# Altium schematic sheet FanControl.SchDoc: =ProductName
size 420 x 297 mm; CompanyName: ООО "Тахион"; Organization: ООО "Тахион"; SheetNumber: 1; SheetTotal: 1; PageSetup: Record=PageOptions|CenterHorizontal=True|CenterVertical=True|PrintScale=0.94|XCorrection=1.00|YCorrection=1.00|PrintKind=1|BorderSize=5000000|LeftOffset=0|BottomOffset=0|Orientation=1|PaperLength=1000|PaperWidth=1000|Scale=100|PaperSource=7|PrintQuality=-4|MediaType=1|DitherType=10|PaperKind=A4|PrintScaleMode=1; DocumentName: Sheet1.SCHDOC
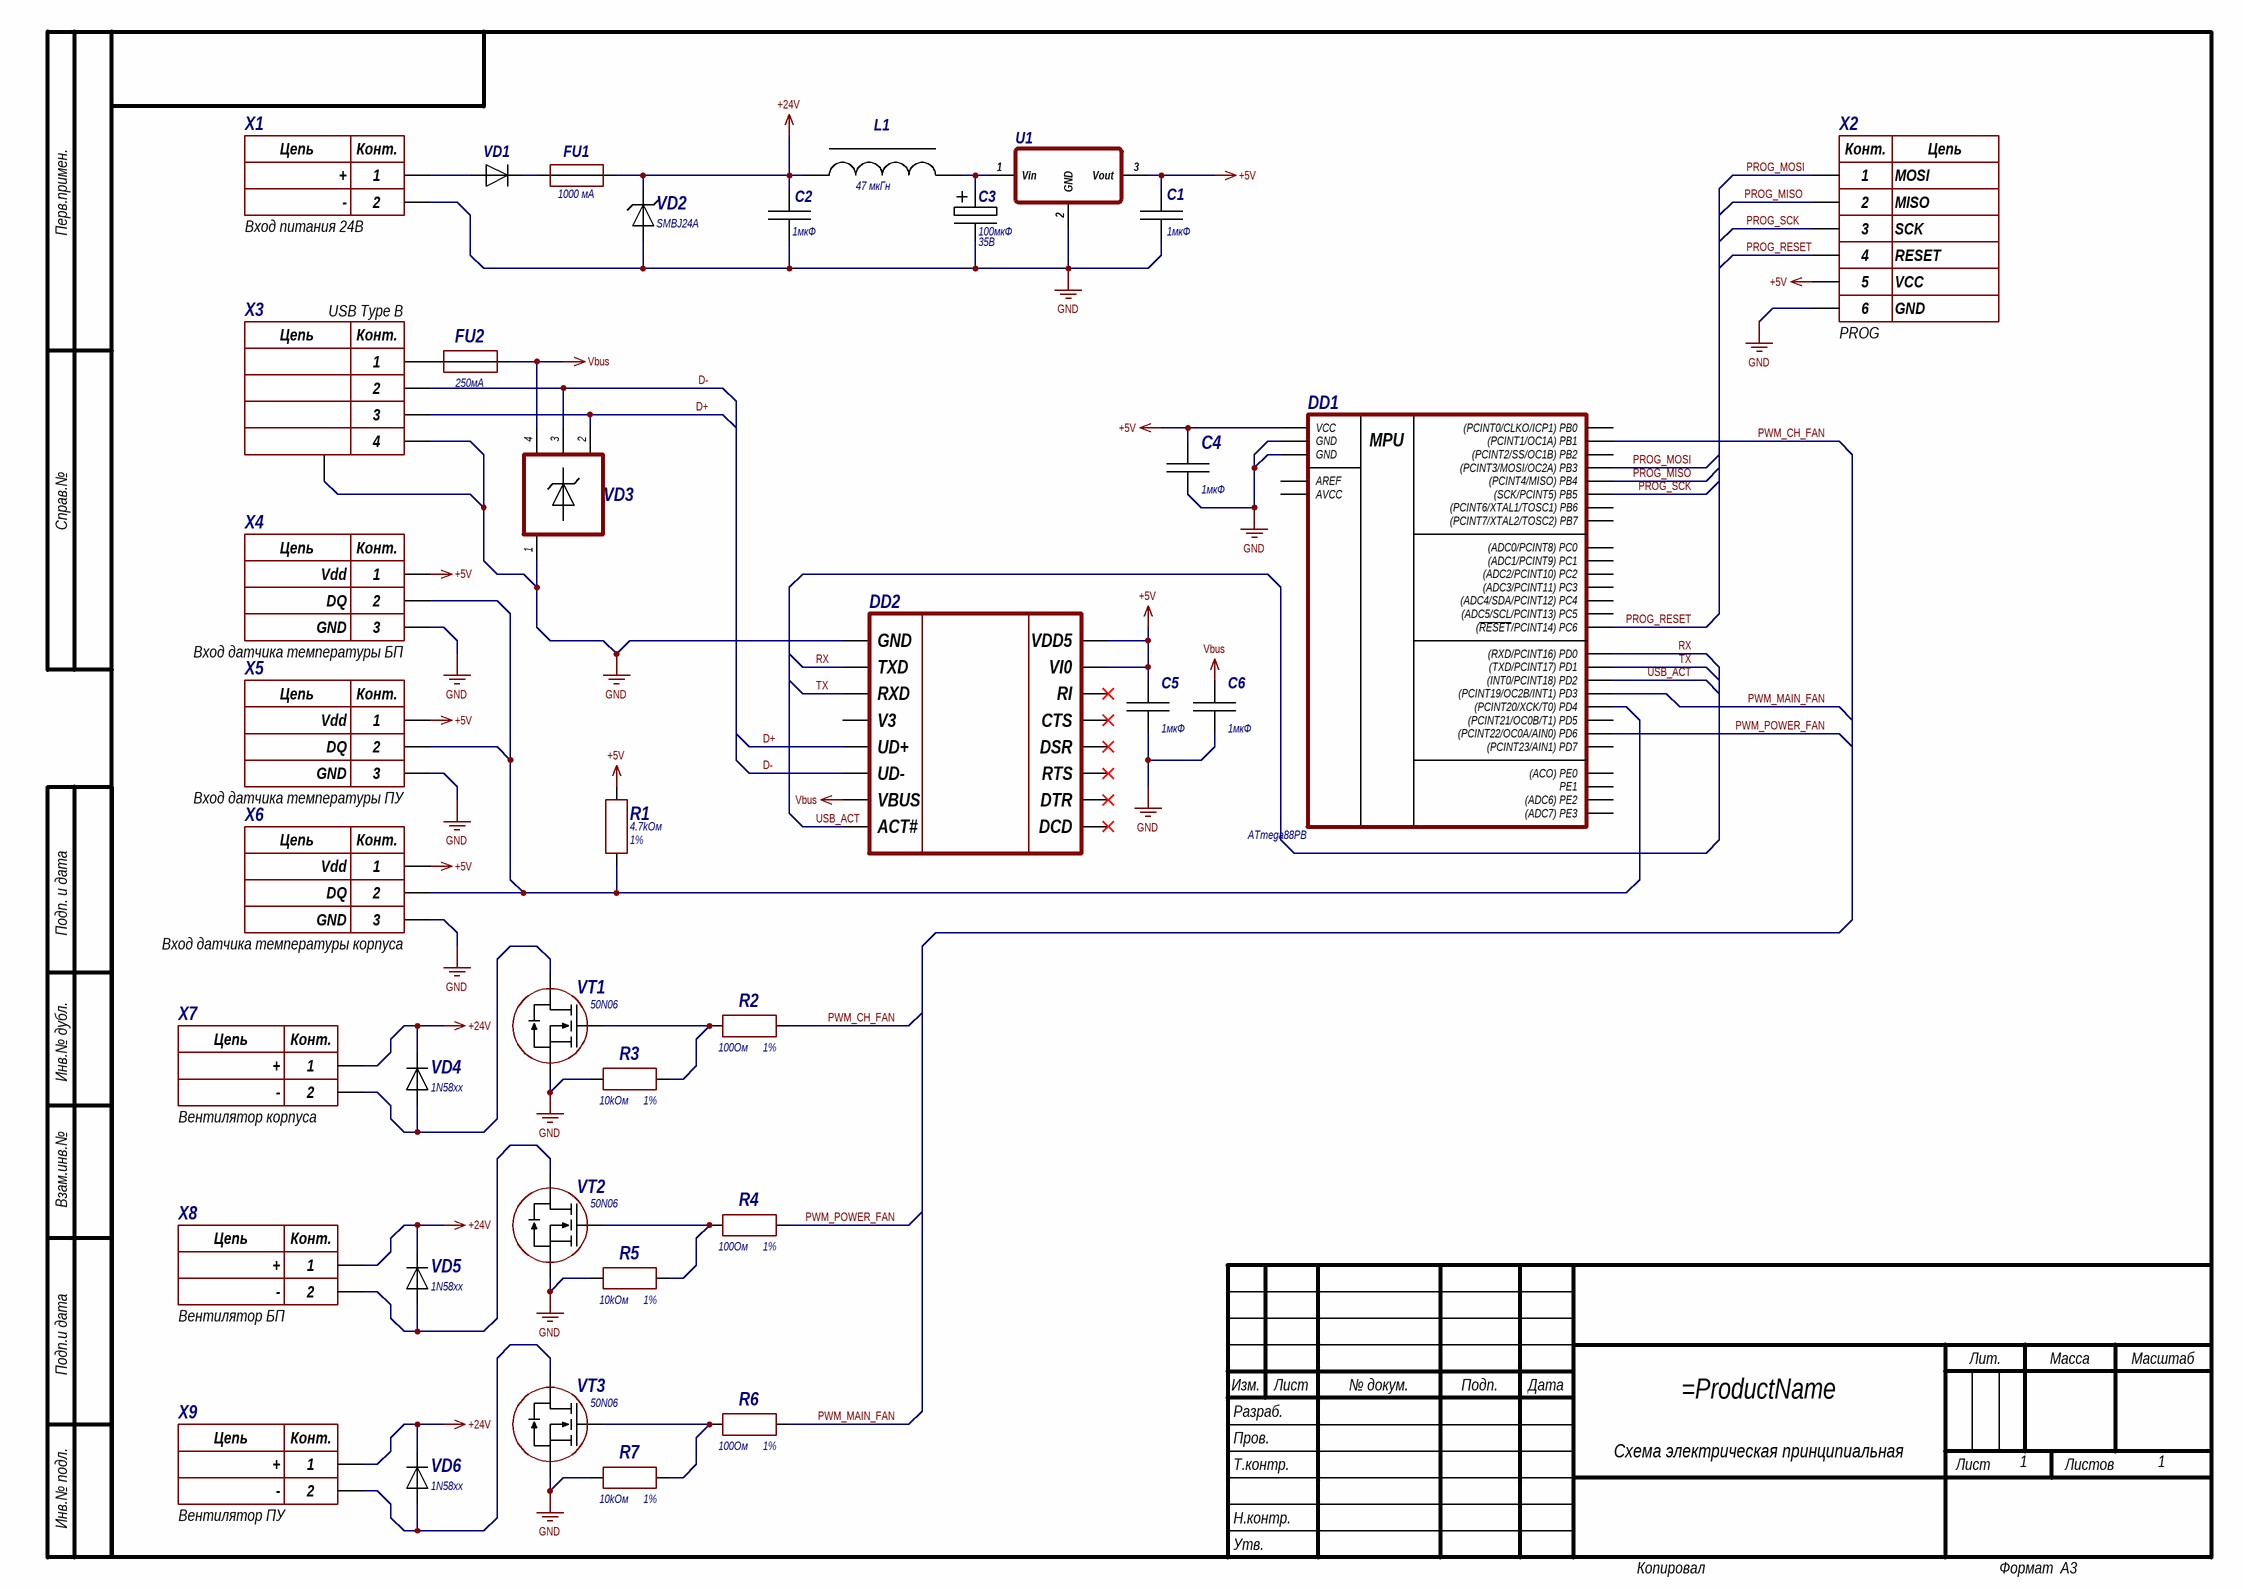
[diagram p0: FanControl.SchDoc]

## Parts
C1  value 1мкФ  [CAP: 0805]  (hidden comment: 0805-X7R-16В-1мкФ±10%)
C2  value 1мкФ  [CAP: 1206]  (hidden comment: 1206-X7R-50В-1мкФ±10%)
C3  value 100мкФ  Voltage: 35В  [UUD]  (hidden comment: ELV-35B-100мкФ±20% тип "D")
C4  value 1мкФ  [FILM Cap]  (hidden comment: 0805-X5R/B-25В-1мкФ±10%)
C5  value 1мкФ  [CAP: 0805]  (hidden comment: 0805-X7R-16В-1мкФ±10%)
C6  value 1мкФ  [CAP: 0805]  (hidden comment: 0805-X7R-16В-1мкФ±10%)
DD1  ATmega8A-AU  [TQFP32]  (value not drawn)
DD2  CH343G  [SOP-16 (1.27, 3.9)]  (value not drawn)
FU1  Сurrent: 1000 мА  [FU: C1]  (hidden comment: 0451001.MRL)
FU2  Сurrent: 250мА  [FU: C1]  (hidden comment: ВП4-18)
L1  Inductance: 47 мкГн  [LQH55D]  (hidden comment: LQH55DN470M03)
R1  value 4.7kОм  Tolerance: 1%  [RES: 0805]  (hidden comment: 0805-0,125Вт-4.7kОм±1%)
R2  value 100Ом  Tolerance: 1%  [RES: 0805]  (hidden comment: 0805-0,125Вт-100Ом±1%)
R3  value 10kОм  Tolerance: 1%  [RES: 0805]  (hidden comment: 0805-0,125Вт-10kОм±1%)
R4  value 100Ом  Tolerance: 1%  [RES: 0805]  (hidden comment: 0805-0,125Вт-100Ом±1%)
R5  value 10kОм  Tolerance: 1%  [RES: 0805]  (hidden comment: 0805-0,125Вт-10kОм±1%)
R6  value 100Ом  Tolerance: 1%  [RES: 0805]  (hidden comment: 0805-0,125Вт-100Ом±1%)
R7  value 10kОм  Tolerance: 1%  [RES: 0805]  (hidden comment: 0805-0,125Вт-10kОм±1%)
U1  LM2940S-5.0/TR  [D2PAK-3]  (value not drawn)
VD1  MBRS2H100T3G  [Diode: SMB (403A)]  (value not drawn)
VD2  SMBJ24A  [Diode: DO-214AA]
VD3  Сборка защитных диодов  [SOT-143]  (value not drawn)
VD4  1N58xx  [Diode: SOD-123]
VD5  1N58xx  [Diode: SOD-123]
VD6  1N58xx  [Diode: SOD-123]
VT1  50N06  [TO-220AB]
VT2  50N06  [TO-220AB]
VT3  50N06  [TO-220AB]
X1  ConName: Вход питания 24В  [PW 10-2-M]  (hidden comment: PW10-02M)
X2  ConName: PROG  [PLD-6]
X3  ConName: USB Type B  [292304-1]
X4  ConName: Вход датчика температуры БП  [WF-3 Hor]  (hidden comment: WF-3R)
X5  ConName: Вход датчика температуры ПУ  [WF-3 Hor]  (hidden comment: WF-3R)
X6  ConName: Вход датчика температуры корпуса  [WF-3 Hor]  (hidden comment: WF-3R)
X7  ConName: Вентилятор корпуса  [PW 10-2-M]  (hidden comment: PW10-02M)
X8  ConName: Вентилятор БП  [PW 10-2-M]  (hidden comment: PW10-02M)
X9  ConName: Вентилятор ПУ  [PW 10-2-M]  (hidden comment: PW10-02M)

## Nets
+5V: C1.1 C4.2 C5.2 DD1.4(VCC) DD2.15(VI0) DD2.16(VDD5) R1.2 U1.3(Vout) X2.5(VCC) X4.1(Vdd) X5.1(Vdd) X6.1(Vdd)
+24V: C2.1 FU1.2 L1.1 VD2.2 VD4.2 VD5.2 VD6.2 X7.1(+) X8.1(+) X9.1(+)
GND: C1.2 C2.2 C3.2 C4.1 C5.1 C6.1 DD1.5(GND) DD1.21(GND) DD2.1(GND) R3.1 R5.1 R7.1 U1.2(GND) VD2.1 VD3.1(GND) VT1.3(I) VT2.3(I) VT3.3(I) X1.2(-) X2.6(GND) X3.4 X3.5 X4.3(GND) X5.3(GND) X6.3(GND)
Vbus: C6.2 DD2.7(VBUS) FU2.2 VD3.4(Vcc)
D+: DD2.5(UD+) VD3.2(I/0_1) X3.3
D-: DD2.6(UD-) VD3.3(I/0_2) X3.2
PROG_MISO: DD1.16((PCINT4/MISO)_PB4) X2.2(MISO)
PROG_MOSI: DD1.15((PCINT3/MOSI/OC2A)_PB3) X2.1(MOSI)
PROG_RESET: DD1.29((~{RESET}/PCINT14)_PC6) X2.4(RESET)
PROG_SCK: DD1.17((SCK/PCINT5)_PB5) X2.3(SCK)
PWM_CH_FAN: DD1.13((PCINT1/OC1A)_PB1) R2.2
PWM_MAIN_FAN: DD1.1((PCINT19/OC2B/INT1)_PD3) R6.2
PWM_POWER_FAN: DD1.10((PCINT22/OC0A/AIN0)_PD6) R4.2
RX: DD1.30((RXD/PCINT16)_PD0) DD2.2(TXD)
TX: DD1.31((TXD/PCINT17)_PD1) DD2.3(RXD)
USB_ACT: DD1.32((INT0/PCINT18)_PD2) DD2.8(ACT#)
NetC3_1: C3.1 L1.2 U1.1(Vin)
NetDD1_2: DD1.2((PCINT20/XCK/T0)_PD4) R1.1 X4.2(DQ) X5.2(DQ) X6.2(DQ)
NetFU1_1: FU1.1 VD1.2
NetFU2_1: FU2.1 X3.1
NetR2_1: R2.1 R3.2 VT1.1(Z)
NetR4_1: R4.1 R5.2 VT2.1(Z)
NetR6_1: R6.1 R7.2 VT3.1(Z)
NetVD1_1: VD1.1 X1.1(+)
NetVD4_1: VD4.1 VT1.2(S) X7.2(-)
NetVD5_1: VD5.1 VT2.2(S) X8.2(-)
NetVD6_1: VD6.1 VT3.2(S) X9.2(-)

Not connected (* = marked no-connect by the designer): DD1 3((ACO)_PE0) 6(PE1) 7((PCINT6/XTAL1/TOSC1)_PB6) 8((PCINT7/XTAL2/TOSC2)_PB7) 9((PCINT21/OC0B/T1)_PD5) 11((PCINT23/AIN1)_PD7) 12((PCINT0/CLKO/ICP1)_PB0) 14((PCINT2/SS/OC1B)_PB2) 18(AVCC) 19((ADC6)_PE2) 20(AREF) 22((ADC7)_PE3) 23((ADC0/PCINT8)_PC0) 24((ADC1/PCINT9)_PC1) 25((ADC2/PCINT10)_PC2) 26((ADC3/PCINT11)_PC3) 27((ADC4/SDA/PCINT12)_PC4) 28((ADC5/SCL/PCINT13)_PC5); DD2 4(V3) 9(DCD)* 10(DTR)* 11(RTS)* 12(DSR)* 13(CTS)* 14(RI)*

## Notes on the sheet
- Типоразмер 2410
- Перв.примен.
- Справ.№
- Подп. и дата
- Инв.№ дубл.
- Взам.инв.№
- Подп.и дата
- Разраб.
- Изм.
- Лист
- № докум.
- Подп.
- Дата
- Лит.
- Масса
- Масштаб
- Т.контр.
- Пров.
- Схема электрическая принципиальная
- Листов
- Инв.№ подл.
- Утв.
- Н.контр.
- Копировал
- Формат  A3
- (in symbol ATmega8/8A/88/168/328) MPU; ATmega88PB
- (in symbol CON2) Цепь; Конт.
- (in symbol CON3) Цепь; Конт.
- (in symbol CON5) Цепь; Конт.
- (in symbol CON6) Конт.; Цепь

## Library data of the parts
C1 = Capactor: Manufacturer: Murata; Part Number: GRM21BR71C105KA01L; Voltage: 16В; TypeDielectric: X7R; Tolerance: 10%; Package: 0805; ComponentLink1Description: Datasheet; ComponentLink1URL: ..\Tahion Devices Library\Datasheet\; ComponentLink2Description: Official Site; ComponentLink3Description: ChipDip
C2 = Capactor: Manufacturer: Murata; Part Number: GRM31BR71H105KA01L; Voltage: 50В; TypeDielectric: X7R; Tolerance: 10%; Package: 1206; ComponentLink1Description: Datasheet; ComponentLink1URL: ..\Tahion Devices Library\Datasheet\; ComponentLink2Description: Official Site; ComponentLink3Description: ChipDip
C3 = Capactor El: конденсатор электролитический 100мкФ 20% 50В SMD; Manufacturer: NICHICON; Tolerance: 20%; Package: ELV; Part Number: ELV-35B-100мкФ±20% тип "D"; ComponentLink1Description: Datasheet; ComponentLink1URL: ..\Tahion Devices Library\Datasheet\; ComponentLink2Description: Official Site; ComponentLink3Description: ChipDip
C4 = Capactor: Voltage: 25В; TypeDielectric: X5R/B; Tolerance: 10%; Package: 0805; ComponentLink1Description: Datasheet; ComponentLink1URL: ..\Tahion Devices Library\Datasheet\; ComponentLink2Description: Official Site; ComponentLink3Description: ChipDip
C5 C6 = Capactor: Manufacturer: Murata; Voltage: 16В; TypeDielectric: X7R; Tolerance: 10%; Package: 0805; ComponentLink1Description: Datasheet; ComponentLink1URL: ..\Tahion Devices Library\Datasheet\; ComponentLink2Description: Official Site; ComponentLink3Description: ChipDip
DD1 = ATmega8/8A/88/168/328: Микроконтроллер 8-Бит, AVR, 16МГц, 8КБ Flash / ATmega8/8A/88/168/328; Manufacturer: Microchip Technology; Flash: 8K; EEPROM: 512B; SRAM: 1K; ComponentLink1Description: Datasheet; ComponentLink2Description: Official Site; ComponentLink3Description: ChipDip; Part Number: ATmega8A-AU
DD2 = CH343P/G: Микросхема преобразователя шины USB, которая конвертирует USB в высокоскоростной последовательный интерфейс UART / Драйвер - VCP/CDC; Manufacturer: Nanjing Qinheng Microelectronics Co., Ltd.; Part Number: CH343G
FU1 = FUSE: Manufacturer: Littelfuse; Voltage: 125В; Value: 1000; Part number: 0451001.MRL; ComponentLink1Description: Datasheet; ComponentLink2Description: Official Site; ComponentLink3Description: ChipDip
FU2 = FUSE: Manufacturer: ОАО "Радиодеталь"; Voltage: 350 В; Part number: ВП4-18; ComponentLink1Description: Datasheet; ComponentLink1URL: ..\Tahion Devices Library\Datasheet\; ComponentLink2Description: Official Site; ComponentLink3Description: ChipDip
L1 = Coil_1: Дроссель; Manufacturer: Murata; Part Number: LQH55DN470M03; ComponentLink1Description: Datasheet; ComponentLink1URL: ..\Tahion Devices Library\Datasheet\; ComponentLink2Description: Official Site; ComponentLink3Description: ChipDip
R1-R7 = Resistor: Power: 0,125Вт; Package: 0805; ComponentLink1Description: Datasheet; ComponentLink2Description: Official Site; ComponentLink3Description: ChipDip
  R1: Part Number: 0805-0,125Вт-4.7kОм±1%
  R2 R4 R6: Part Number: 0805-0,125Вт-100Ом±1%
  R3 R5 R7: Part Number: 0805-0,125Вт-10kОм±1%
U1 = Voltage stabilizer: Линейный стабилизатор, вход 6.2-26В, выход 5В/1А; Manufacturer: Texas Instruments; Output voltage: 5В; Maximum input voltage: 26В; Maximum current: 1А; Number of outputs: 1; Part Number: LM2940S-5.0/TR; ComponentLink1Description: Datasheet; ComponentLink1URL: ..\Tahion Devices Library\Datasheet\; ComponentLink2Description: Official Site; ComponentLink3Description: ChipDip
VD1 = Diode: Диод Шоттки; Manufacturer: ON Semiconductor; Max. reverse voltage: 20 В; Part Number: MBRS2H100T3G; ComponentLink1Description: Datasheet; ComponentLink1URL: ..\Tahion Devices Library\Datasheet\MBR0520L.pdf; ComponentLink2Description: Official Site; ComponentLink3Description: ChipDip; ComponentLink2URL: https://www.onsemi.com/products/discrete-power-modules/schottky-diodes-schottky-rectifiers/MBR0520L; ComponentLink3URL: https://www.chipdip.ru/product/mbr0520l
VD2 = Diode TVS: Защитный диод; Manufacturer: UMW (Youtai Semiconductor Co., Ltd.); Part Number: SMBJ24A
VD3 = PRTR5V0U2X: Manufacturer: NXP; Value: 5В; Part Number: PRTR5V0U2X
VD4-VD6 = Diode: Part Number: 1N58xx; ComponentLink1Description: Datasheet; ComponentLink1URL: ..\Tahion Devices Library\Datasheet\MBR0520L.pdf; ComponentLink2Description: Official Site; ComponentLink3Description: ChipDip; ComponentLink2URL: https://www.onsemi.com/products/discrete-power-modules/schottky-diodes-schottky-rectifiers/MBR0520L; ComponentLink3URL: https://www.chipdip.ru/product/mbr0520l
VT1-VT3 = FET SPEED: Транзистор N-MOSFET; Manufacturer: UTD Semiconductor Co.,Ltd; Part Number: 50N06; ComponentLink1Description: Datasheet; ComponentLink1URL: ..\Tahion Devices Library\Datasheet\; ComponentLink2Description: Official Site; ComponentLink3Description: ChipDip
X1 X7-X9 = CON2: Part Number: PW10-02M; ComponentLink1Description: Datasheet; ComponentLink2Description: Official Site; ComponentLink3Description: ChipDip
X2 = CON6: ComponentLink1Description: Datasheet; ComponentLink1URL: ..\Tahion Devices Library\Datasheet\; ComponentLink2Description: Official Site; ComponentLink3Description: ChipDip
X3 = CON5: ComponentLink1Description: Datasheet; ComponentLink1URL: ..\Tahion Devices Library\Datasheet\; ComponentLink2Description: Official Site; ComponentLink3Description: ChipDip
X4-X6 = CON3: Part Number: WF-3R; ComponentLink1Description: Datasheet; ComponentLink1URL: ..\Tahion Devices Library\Datasheet\; ComponentLink2Description: Official Site; ComponentLink3Description: ChipDip